# Altium project 15336-ROM3_tablet_RJ12.PrjPcb
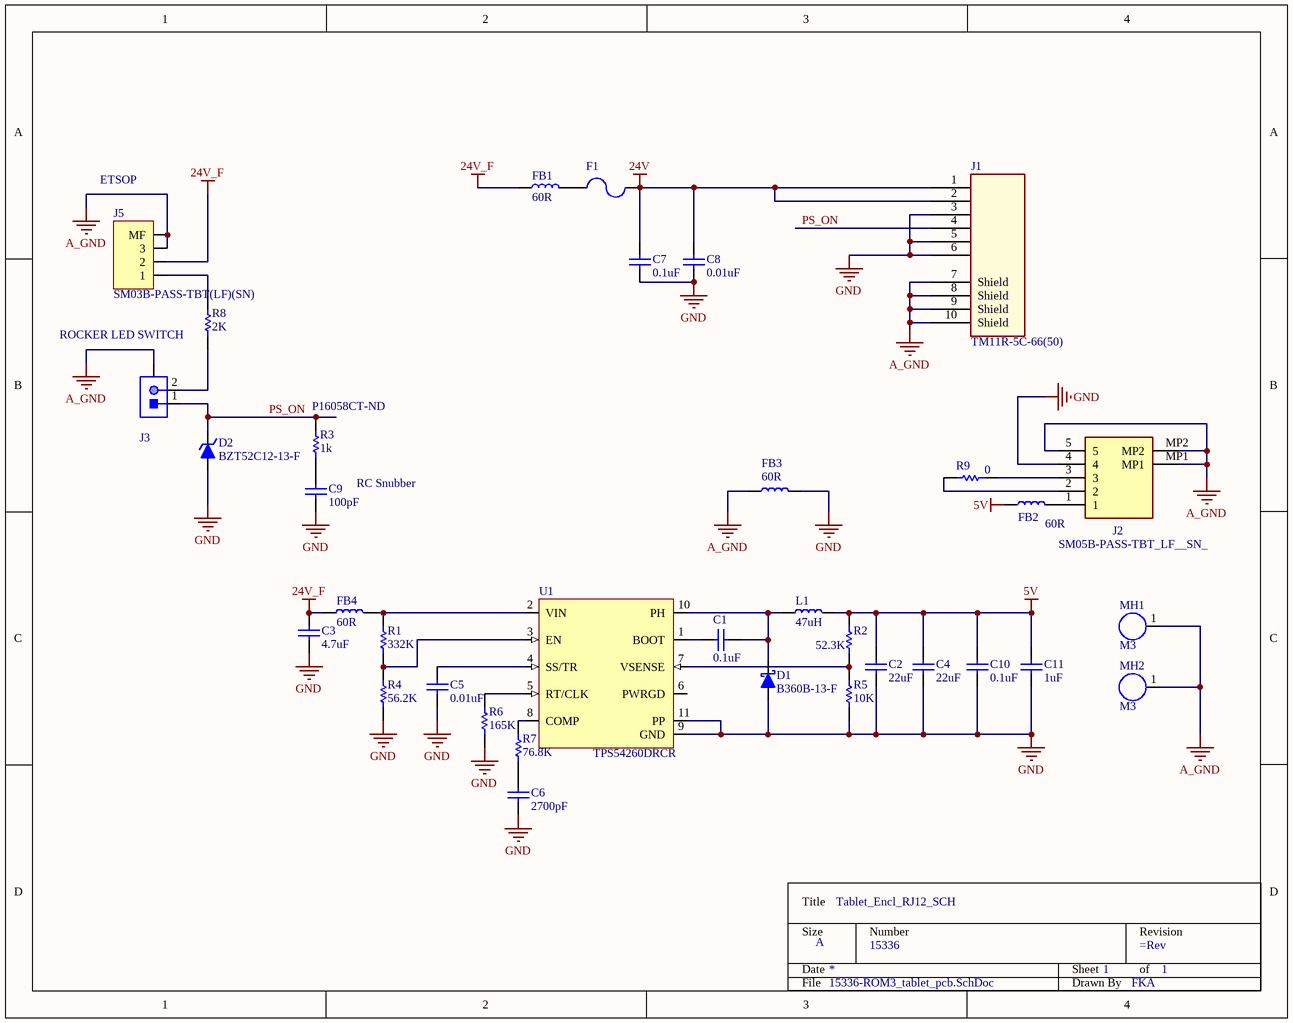
[diagram p0: 15336-ROM3_tablet_pcb.SchDoc]
Company: ROM Tech; PartNum: 15336; Rev: 3
1 sheet, 36 parts. Net scope: global (net labels, ports and power ports of the same name join across sheets).
Board file: 15336-ROM3_tablet_RJ12.PcbDoc

## Sheet 15336-ROM3_tablet_pcb.SchDoc: Tablet_Encl_RJ12_SCH
size A; DrawnBy: FKA; DocumentNumber: 15336; Revision: 3; SheetNumber: 1; SheetTotal: 1

### Parts
?  (no value)  (graphical)
C1  0.1uF  [CAPC0402X06N]
C2  22uF  [CAPC0603X10N]
C3  4.7uF  [CAPC0603X10N]
C4  22uF  [CAPC0603X10N]
C5  0.01uF  [CAPC0402X06N]
C6  2700pF  [CAPC0402X06N]
C7  0.1uF  [CAPC0402X06N]
C8  0.01uF  [CAPC0402X06N]
C9  100pF  [CAPC0603X10N]
C10  0.1uF  [CAPC0402X06N]
C11  1uF  [CAPC0402X06N]
D1  B360B-13-F  [SMB]
D2  BZT52C12-13-F  [SOD-123/Mini-SMA]
F1  Fuse  [FUSE2920]  (value not drawn)
FB1  60R  [Ferrite 0805]
FB2  60R  [Ferrite 0805]
FB3  60R  [Ferrite 0805]
FB4  60R  [Ferrite 0805]
J1  TM11R-5C-66(50)  [RJ12]
J2  SM05B-PASS-TBT_LF__SN_  [SM05BPASSTBTLFSN]
J3  SM02B-PASS-TBT(LF)(SN)  [SM02B-PASS-TBT(LF)(SN)]  (value not drawn)
J5  SM03B-PASS-TBT(LF)(SN)  [SM03B-PASS-TBT(LF)(SN)]
L1  47uH  [SRN1060]
MH1  M3  [M3_Hole]
MH2  M3  [M3_Hole]
R1  332K  [RESC0402X04N]
R2  52.3K  [RESC0402X04N]
R3  1k  Supplier Part Number 1: P16058CT-ND  [RESC0805X06N]
R4  56.2K  [RESC0402X04N]
R5  10K  [RESC0402X04N]
R6  165K  [RESC0402X04N]
R7  76.8K  [RESC0402X04N]
R8  2K  [RESC1206X09N]
R9  0  [RESC0603X06N]
U1  TPS54260DRCR  [10-VSON (3x3) EXPOSED]

### Nets
5V: C2.2 C4.2 C10.1 C11.2 FB2.1 L1.2 R2.1
24V: C7.1 C8.2 F1.2 J1.1 J1.2
24V_F: C3.2 FB1.1 FB4.1 J5.2
A_GND: FB3.1 J1.7(Shield) J1.8(Shield) J1.9(Shield) J1.10(Shield) J2.5 J2.MP1 J2.MP2 J3.3(MF) J5.3 J5.MF MH1.1 MH2.1
GND: C2.1 C3.1 C4.1 C5.1 C6.1 C7.2 C8.1 C9.2 C10.2 C11.1 D1.1(A) D2.1(A) FB3.2 J1.3 J1.5 J1.6 J2.4 R4.1 R5.2 R6.1 U1.9(GND) U1.11(PP)
PS_ON: D2.2(K) J1.4 J3.1 R3.2
NetC1_1: C1.1 D1.2(K) L1.1 U1.10(PH)
NetC1_2: C1.2 U1.1(BOOT)
NetC5_2: C5.2 U1.4(SS/TR)
NetC6_2: C6.2 R7.2
NetC9_1: C9.1 R3.1
NetF1_1: F1.1 FB1.2
NetFB2_2: FB2.2 J2.1
NetFB4_2: FB4.2 R1.2 U1.2(VIN)
NetJ2_2: J2.2 R9.1
NetJ2_3: J2.3 R9.2
NetJ3_2: J3.2 R8.1
NetJ5_1: J5.1 R8.2
NetR1_1: R1.1 R4.2 U1.3(EN)
NetR2_2: R2.2 R5.1 U1.7(VSENSE)
NetR6_2: R6.2 U1.5(RT/CLK)
NetR7_1: R7.1 U1.8(COMP)

Not connected (* = marked no-connect by the designer): U1 6(PWRGD)

### Notes on the sheet
- (near J5) ETSOP
- ROCKER LED SWITCH
- RC Snubber
- Title
- Size
- Date
- A
- Number
- Sheet
- Revision
- of
- File
- Drawn By

### Library data of the parts
? = Title Block Standard_+
C1 C7 C10 = Cap NP: 0.1µF ±10% 50V Ceramic Capacitor X5R 0402 (1005 Metric); Manufacturer 1: Yageo; Manufacturer Part Number 1: CC0402KRX5R9BB104; Capacitance: 100nF; Value: 0.1uF; Supplier 1: Digi-Key; Supplier Part Number 1: 311-3342-2-ND; Stock 1: 827511; Pricing 1: 10000=0.00666, 20000=0.00634, 30000=0.00602, 50000=0.00539, 100000=0.00476 (USD); RoHS: Yes; Mount: Surface Mount; Case/Package: 0402; Min Operating Temperature: -55°C; Max Operating Temperature: 85°C; Packaging: Tape and Reel; Voltage Rating: 50V; Tolerance: 10%; Voltage Rating (DC): 50V; Dielectric: X5R; Length: 0.039inch; Width: 0.02inch; Thickness: 0.022inch; Lead Free: Lead Free; Halogen Free: Halogen Free; ComponentLink1URL: http://www.yageo.com/documents/recent/UPY-GPHC_X5R_4V-to-50V_23.pdf?src-supplier=Digi-Key; ComponentLink1Description: http://www.yageo.com/documents/recent/UPY-GPHC_X5R_4V-to-50V_23.pdf?src-supplier=Digi-Key; ComponentLink2URL: http://www.yageo.com/documents/recent/UPY-GPHC_X5R_4V-to-50V_25.pdf?src-supplier=Digi-Key; ComponentLink2Description: http://www.yageo.com/documents/recent/UPY-GPHC_X5R_4V-to-50V_25.pdf?src-supplier=Digi-Key
C2 C4 = Cap NP: 22µF ±20% 6.3V Ceramic Capacitor X5R 0603 (1608 Metric); Manufacturer 1: Murata; Manufacturer Part Number 1: GRM188R60J226MEA0D; Value: 22uF; Supplier 1: Digi-Key; Supplier Part Number 1: 490-7611-2-ND; Stock 1: 5622507; Pricing 1: 4000=0.04731, 8000=0.04475, 12000=0.04245, 28000=0.04091, 100000=0.03580 (USD); RoHS: Yes; Mount: Surface Mount; Case/Package: 0603; Weight: 0.000222oz; Case Code (Metric): 1608; Case Code (Imperial): 0603; Min Operating Temperature: -55°C; Max Operating Temperature: 85°C; Capacitance: 22uF; Tolerance: 20%; Packaging: Tape and Reel; Package Quantity: 4000; Voltage Rating: 6.3V; Dielectric: X5R; Termination: SMD/SMT; Voltage Rating (DC): 6.3V; Length: 1.6mm; Height: 0.8mm; Width: 0.8mm; Thickness: 0.039inch; Depth: 0.8mm; REACH SVHC: No SVHC; Lead Free: Lead Free; ComponentLink1URL: https://datasheet.ciiva.com/29540/partnumbering-e-01-29540441.pdf?src-supplier=Digi-Key; ComponentLink1Description: https://datasheet.ciiva.com/29540/partnumbering-e-01-29540441.pdf?src-supplier=Digi-Key; ComponentLink2URL: https://datasheet.ciiva.com/29540/partnumbering-e-01-29540442.pdf?src-supplier=Digi-Key; ComponentLink2Description: https://datasheet.ciiva.com/29540/partnumbering-e-01-29540442.pdf?src-supplier=Digi-Key; ComponentLink3URL: https://datasheet.ciiva.com/29540/partnumbering-e-01-29540443.pdf?src-supplier=Digi-Key; ComponentLink3Description: https://datasheet.ciiva.com/29540/partnumbering-e-01-29540443.pdf?src-supplier=Digi-Key
C3 = Cap NP: 4.7µF ±10% 35V Ceramic Capacitor X5R 0603 (1608 Metric); Manufacturer 1: Murata; Manufacturer Part Number 1: GRM188R6YA475KE15D; Value: 4.7uF; Supplier 1: Digi-Key; Supplier Part Number 1: 490-7205-2-ND; Stock 1: 280000; Pricing 1: 4000=0.09384, 8000=0.08832, 12000=0.08556, 28000=0.08280, 100000=0.07728 (USD); RoHS: Yes; Mount: Surface Mount; Case/Package: 0603; Weight: 0.000222oz; Case Code (Metric): 1608; Case Code (Imperial): 0603; Material: Ceramic; Min Operating Temperature: -55°C; Max Operating Temperature: 85°C; Capacitance: 4.7uF; Tolerance: 10%; Voltage Rating: 35V; Packaging: Tape and Reel; Package Quantity: 4000; Dielectric: X5R; Voltage: 35V; Termination: SMD/SMT; Composition: Ceramic; Voltage Rating (DC): 35V; Length: 1.6mm; Height: 0.8mm; Width: 0.8mm; Thickness: 0.031inch; Depth: 0.8mm; REACH SVHC: No SVHC; Lead Free: Lead Free; ComponentLink1URL: https://datasheet.ciiva.com/46444/1769893-46444984.pdf?src-supplier=Element14; ComponentLink1Description: https://datasheet.ciiva.com/46444/1769893-46444984.pdf?src-supplier=Element14; ComponentLink2URL: https://datasheet.ciiva.com/46444/1769893-46444985.pdf?src-supplier=Element14; ComponentLink2Description: https://datasheet.ciiva.com/46444/1769893-46444985.pdf?src-supplier=Element14; ComponentLink3URL: https://datasheet.ciiva.com/14906/partnumbering-e-01-14906426.pdf?src-supplier=Digi-Key; ComponentLink3Description: https://datasheet.ciiva.com/14906/partnumbering-e-01-14906426.pdf?src-supplier=Digi-Key; ComponentLink4URL: https://datasheet.ciiva.com/14906/partnumbering-e-01-14906427.pdf?src-supplier=Digi-Key; ComponentLink4Description: https://datasheet.ciiva.com/14906/partnumbering-e-01-14906427.pdf?src-supplier=Digi-Key; ComponentLink5URL: https://datasheet.ciiva.com/14906/partnumbering-e-01-14906428.pdf?src-supplier=Digi-Key; ComponentLink5Description: https://datasheet.ciiva.com/14906/partnumbering-e-01-14906428.pdf?src-supplier=Digi-Key
C5 C8 = Cap NP: 10000pF ±10% 50V Ceramic Capacitor X7R 0402 (1005 Metric); Manufacturer 1: Yageo; Manufacturer Part Number 1: CC0402KRX7R9BB103; Capacitance: 10nF; Value: 0.01uF; Supplier 1: Digi-Key; Supplier Part Number 1: 311-1349-2-ND; Stock 1: 2489775; Pricing 1: 10000=0.00309, 20000=0.00294, 30000=0.00279, 50000=0.00250, 100000=0.00206 (USD); RoHS: Yes; Mount: Surface Mount; Case/Package: 0402; Case Code (Imperial): 0402; Case Code (Metric): 1005; Min Operating Temperature: -55°C; Max Operating Temperature: 125°C; Packaging: Tape and Reel; Voltage Rating: 50V; Package Quantity: 1; Tolerance: 10%; Voltage Rating (DC): 50V; Dielectric: X7R; Termination: SMD/SMT; Composition: Ceramic; Voltage: 50V; Length: 1mm; Height: 0.5mm; Depth: 0.5mm; Width: 0.5mm; Thickness: 0.022inch; Radiation Hardening: No; REACH SVHC: No SVHC; Lead Free: Lead Free; Halogen Free: Halogen Free; ComponentLink1URL: https://datasheet.ciiva.com/26862/getdatasheetpartid-138248-26862642.pdf?src-supplier=Verical; ComponentLink1Description: https://datasheet.ciiva.com/26862/getdatasheetpartid-138248-26862642.pdf?src-supplier=Verical; ComponentLink2URL: https://datasheet.ciiva.com/11788/0900766b8079c870-11788375.pdf?src-supplier=RSComponents; ComponentLink2Description: https://datasheet.ciiva.com/11788/0900766b8079c870-11788375.pdf?src-supplier=RSComponents; ComponentLink3URL: https://datasheet.ciiva.com/16625/upy-gphc-x7r-6-3v-to-50v-8-16625513.pdf?src-supplier=Avnet+Europe; ComponentLink3Description: https://datasheet.ciiva.com/16625/upy-gphc-x7r-6-3v-to-50v-8-16625513.pdf?src-supplier=Avnet+Europe; ComponentLink4URL: https://datasheet.ciiva.com/28450/1489800-28450377.pdf?src-supplier=Element14; ComponentLink4Description: https://datasheet.ciiva.com/28450/1489800-28450377.pdf?src-supplier=Element14; ComponentLink5URL: https://datasheet.ciiva.com/176/mlccorderingcode-176348.pdf?src-supplier=Digi-Key; ComponentLink5Description: https://datasheet.ciiva.com/176/mlccorderingcode-176348.pdf?src-supplier=Digi-Key; ComponentLink6URL: https://datasheet.ciiva.com/176/mlccorderingcode-176349.pdf?src-supplier=Digi-Key; ComponentLink6Description: https://datasheet.ciiva.com/176/mlccorderingcode-176349.pdf?src-supplier=Digi-Key; ComponentLink7URL: https://datasheet.ciiva.com/7978/1489800-7978093.pdf?src-supplier=Element14; ComponentLink7Description: https://datasheet.ciiva.com/7978/1489800-7978093.pdf?src-supplier=Element14; ComponentLink8URL: https://datasheet.ciiva.com/176/mlccorderingcode-176350.pdf?src-supplier=Digi-Key; ComponentLink8Description: https://datasheet.ciiva.com/176/mlccorderingcode-176350.pdf?src-supplier=Digi-Key
C6 = Cap NP: 2700pF ±10% 50V Ceramic Capacitor X7R 0402 (1005 Metric); Manufacturer 1: Murata; Manufacturer Part Number 1: GRM155R71H272KA01J; Capacitance: 2.7nF; Value: 2700pF; Supplier 1: Digi-Key; Supplier Part Number 1: 490-6361-2-ND; Stock 1: 250000; Pricing 1: 50000=0.00391, 100000=0.00345 (USD); RoHS: Yes; Mount: Surface Mount; Case/Package: 0402; Case Code (Metric): 1005; Case Code (Imperial): 0402; Min Operating Temperature: -55°C; Max Operating Temperature: 125°C; Tolerance: 10%; Packaging: Tape and Reel; Package Quantity: 50000; Voltage Rating: 50V; Voltage Rating (DC): 50V; Dielectric: X7R; Termination: SMD/SMT; Voltage: 50V; Length: 1mm; Height: 0.5mm; Width: 0.02inch; Thickness: 0.022inch; Depth: 0.5mm; Radiation Hardening: No; ComponentLink1URL: https://datasheet.ciiva.com/6271/partnumbering-e-01-6271238.pdf?src-supplier=Digi-Key; ComponentLink1Description: https://datasheet.ciiva.com/6271/partnumbering-e-01-6271238.pdf?src-supplier=Digi-Key; ComponentLink2URL: https://datasheet.ciiva.com/6271/partnumbering-e-01-6271240.pdf?src-supplier=Digi-Key; ComponentLink2Description: https://datasheet.ciiva.com/6271/partnumbering-e-01-6271240.pdf?src-supplier=Digi-Key; ComponentLink3URL: https://datasheet.ciiva.com/6271/partnumbering-e-01-6271242.pdf?src-supplier=Digi-Key; ComponentLink3Description: https://datasheet.ciiva.com/6271/partnumbering-e-01-6271242.pdf?src-supplier=Digi-Key; ComponentLink4URL: https://datasheet.ciiva.com/11620/product-11620523.pdf?src-supplier=Avnet; ComponentLink4Description: https://datasheet.ciiva.com/11620/product-11620523.pdf?src-supplier=Avnet
C9 = Cap NP: Non-polarized Capactior; Value: 100pF; Supplier 1: Digi-Key; Supplier Part Number 1: 490-11435-1-ND
C11 = Cap NP: 1µF ±10% 6.3V Ceramic Capacitor X5R 0402 (1005 Metric); Manufacturer 1: KEMET; Manufacturer Part Number 1: C0402C105K9PACTU; Value: 1uF; Supplier 1: Digi-Key; Supplier Part Number 1: 399-4873-2-ND; Stock 1: 1587114; Pricing 1: 10000=0.00439, 20000=0.00418, 30000=0.00397, 50000=0.00355, 100000=0.00287 (USD); RoHS: Yes; Mount: Surface Mount; Case/Package: 0402; Number of Pins: 2; Case Code (Imperial): 0402; Dielectric Material: Ceramic; Min Operating Temperature: -55°C; Max Operating Temperature: 85°C; Capacitance: 1uF; Tolerance: 10%; Packaging: Tape and Reel; Voltage Rating: 6.3V; Dielectric: X5R; Voltage: 6.3V; Termination: SMD/SMT; Voltage Rating (DC): 6.3V; Package Quantity: 1; Length: 1mm; Height: 0.5mm; Width: 0.02inch; Thickness: 0.022inch; Depth: 0.5mm; Lead Pitch: 0.3mm; Radiation Hardening: No; Lead Free: Lead Free; REACH SVHC: No SVHC; ComponentLink1URL: https://datasheet.ciiva.com/11786/0900766b8116eb59-11786028.pdf?src-supplier=RSComponents; ComponentLink1Description: https://datasheet.ciiva.com/11786/0900766b8116eb59-11786028.pdf?src-supplier=RSComponents; ComponentLink2URL: https://datasheet.ciiva.com/28645/1789732-28645392.pdf?src-supplier=Element14; ComponentLink2Description: https://datasheet.ciiva.com/28645/1789732-28645392.pdf?src-supplier=Element14; ComponentLink3URL: https://datasheet.ciiva.com/7747/kem-c1006-x5r-smd-7747445.pdf?src-supplier=Element14; ComponentLink3Description: https://datasheet.ciiva.com/7747/kem-c1006-x5r-smd-7747445.pdf?src-supplier=Element14; ComponentLink4URL: https://datasheet.ciiva.com/7747/40889-7747623.pdf?src-supplier=Element14; ComponentLink4Description: https://datasheet.ciiva.com/7747/40889-7747623.pdf?src-supplier=Element14
D1 = B360B-13-F: Diode Schottky 60V 3A Surface Mount SMB; Manufacturer 1: Diodes; Forward Voltage: 700mV; Peak Reverse Current: 500uA; Max Forward Surge Current (Ifsm): 100A; Element Configuration: Single; Polarity: Standard; Capacitance: 250pF; Supplier 1: Digi-Key; Supplier Part Number 1: B360B-FDITR-ND; Stock 1: 54000; Pricing 1: 3000=0.14090, 6000=0.12726, 15000=0.11817, 30000=0.11544, 75000=0.11181 (USD); RoHS: Yes; Packaging: Tape and Reel; Height: 2.5mm; Length: 4.57mm; Width: 3.94mm; ComponentLink1URL: https://datasheet.ciiva.com/34302/1538911-34302362.pdf?src-supplier=Jameco; ComponentLink1Description: https://datasheet.ciiva.com/34302/1538911-34302362.pdf?src-supplier=Jameco; ComponentLink2URL: https://datasheet.ciiva.com/26949/getdatasheetpartid-142114-26949359.pdf?src-supplier=Verical; ComponentLink2Description: https://datasheet.ciiva.com/26949/getdatasheetpartid-142114-26949359.pdf?src-supplier=Verical; ComponentLink3URL: https://datasheet.ciiva.com/1177/ds30924-1177528.pdf?src-supplier=Element14; ComponentLink3Description: https://datasheet.ciiva.com/1177/ds30924-1177528.pdf?src-supplier=Element14; Manufacturer Part Number 1: B360B-13-F; Mount: Surface Mount; Case/Package: SMB; Number of Pins: 2; Weight: 0.00328oz; Contact Plating: Tin,Matte; Min Operating Temperature: -55°C; Max Operating Temperature: 150°C; Current: 3A; Voltage: 60V; Package Quantity: 3000; Forward Current: 3A; Average Rectified Current: 3A; Max Repetitive Reverse Voltage (Vrrm): 60V; Peak Non-Repetitive Surge Current: 100A; Termination: SMD/SMT; Voltage Rating (DC): 60V; Current Rating: 3A; Output Current: 3A; Max Reverse Voltage (DC): 60V; Radiation Hardening: No; REACH SVHC: No SVHC; Lead Free: Lead Free
D2 = BZT52C12-13-F: Zener Diode 12V 500mW ±5% Surface Mount SOD-123; Manufacturer 1: Diodes; Impedance: 25R; Peak Reverse Current: 100nA; Test Current: 5mA; Element Configuration: Single; Forward Voltage: 900mV; Output Current: 50mA; ESD Protection: No; Supplier 1: Digi-Key; Manufacturer Part Number 1: BZT52C12-13-F; Stock 1: 88458; Pricing 1: 10000=0.02576, 30000=0.02530, 50000=0.02273, 100000=0.02015, 250000=0.01970 (USD); RoHS: Yes; Mount: Surface Mount; Case/Package: SOD-123-2; Number of Pins: 2; Weight: 0.000353oz; Contact Plating: Tin,Matte; Min Operating Temperature: -65°C; Max Operating Temperature: 150°C; Max Power Dissipation: 500mW; Packaging: Tape and Reel; Package Quantity: 10000; Tolerance: 5%; Zener Voltage: 12V; Voltage Tolerance: 5%; Max Reverse Leakage Current: 100nA; Power Dissipation: 500mW; Zener Current: 100nA; Power Rating: 500mW; Length: 2.85mm; Height: 1.35mm; Width: 1.7mm; Radiation Hardening: No; Lead Free: Lead Free; ComponentLink1URL: https://datasheet.ciiva.com/26943/getdatasheetpartid-38893-26943274.pdf?src-supplier=Verical; ComponentLink1Description: https://datasheet.ciiva.com/26943/getdatasheetpartid-38893-26943274.pdf?src-supplier=Verical; Supplier Part Number 1: BZT52C1213-FDITR-ND; Voltage Rating (DC): 12V
F1 = Fuse: Polymeric PTC Resettable Fuse 33V 1.85A Ih Surface Mount 2920 (7351 Metric), Concave; Manufacturer 1: Bel; Manufacturer Part Number 1: 0ZCF0185FF2C; Max Current Rating: 40A; Trip Current: 3.7A; Time to Trip: 2.5s; Supplier 1: Digi-Key; Supplier Part Number 1: 507-1747-2-ND; Stock 1: 76000; Pricing 1: 2000=0.13090, 4000=0.12320, 6000=0.11550, 10000=0.10780 (USD); RoHS: Yes; Case Code (Metric): 7351; Case Code (Imperial): 2920; Package Quantity: 1; Packaging: Tape and Reel; Hold Current: 1.85A; Lead Free: Lead Free; ComponentLink1URL: https://datasheet.ciiva.com/18550/0zcf-18550652.pdf?src-supplier=Digi-Key; ComponentLink1Description: https://datasheet.ciiva.com/18550/0zcf-18550652.pdf?src-supplier=Digi-Key; ComponentLink2URL: https://datasheet.ciiva.com/18550/0zcf-18550653.pdf?src-supplier=Digi-Key; ComponentLink2Description: https://datasheet.ciiva.com/18550/0zcf-18550653.pdf?src-supplier=Digi-Key; ComponentLink3URL: https://datasheet.ciiva.com/18550/0zcf-18550654.pdf?src-supplier=Digi-Key; ComponentLink3Description: https://datasheet.ciiva.com/18550/0zcf-18550654.pdf?src-supplier=Digi-Key
FB1-FB4 = Ferrite: 60 Ohms @ 100MHz 1 Power Line Ferrite Bead 0805 (2012 Metric) 3A 25mOhm; Manufacturer 1: Taiyo Yuden; Manufacturer Part Number 1: BKP2125HS600-T; Tolerance: 25%; Resistance: 25mR; Number of Lines: 1; Shielding: Unshielded; Value: 60R; Supplier 1: Digi-Key; Supplier Part Number 1: 587-1932-2-ND; Stock 1: 1324000; Pricing 1: 4000=0.01936, 8000=0.01755, 12000=0.01694, 28000=0.01573, 100000=0.01555 (USD); RoHS: Yes; Mount: Surface Mount; Case/Package: 0805; Number of Pins: 2; Core Material: Ferrite; Case Code (Metric): 2125; Case Code (Imperial): 0805; Min Operating Temperature: -55°C; Max Operating Temperature: 85°C; Packaging: Tape and Reel; Impedance: 60R; Package Quantity: 1; Max Current Rating: 3A; DC Resistance (DCR): 25mR; Max DC Current: 3A; Termination: SMD/SMT; Test Frequency: 100MHz; Length: 2.3mm; Height: 1.05mm; Width: 0.049inch; Depth: 1.45mm; REACH SVHC: Unknown; Lead Free: Lead Free; Halogen Free: Halogen Free; ComponentLink1URL: https://datasheet.ciiva.com/6213/bkp2125hs600-t-ss-6213090.pdf?src-supplier=Digi-Key; ComponentLink1Description: https://datasheet.ciiva.com/6213/bkp2125hs600-t-ss-6213090.pdf?src-supplier=Digi-Key; ComponentLink2URL: https://datasheet.ciiva.com/30063/884bkp2125hs600-t-30063956.pdf?src-supplier=Onlinecomponents.com; ComponentLink2Description: https://datasheet.ciiva.com/30063/884bkp2125hs600-t-30063956.pdf?src-supplier=Onlinecomponents.com; ComponentLink3URL: https://datasheet.ciiva.com/6213/mlci08-e-6213094.pdf?src-supplier=Digi-Key; ComponentLink3Description: https://datasheet.ciiva.com/6213/mlci08-e-6213094.pdf?src-supplier=Digi-Key; ComponentLink4URL: https://datasheet.ciiva.com/6213/mlci08-e-6213097.pdf?src-supplier=Digi-Key; ComponentLink4Description: https://datasheet.ciiva.com/6213/mlci08-e-6213097.pdf?src-supplier=Digi-Key
J1 = RJ12: CONN MOD JACK 6P6C R/A SHIELDED; Manufacturer 1: Hirose Electric company; Supplier 1: Digi-Key; Supplier Part Number 1: H124439-ND; Manufacturer Part Number 1: TM11R-5C-66(50)
J2 = SM05B-PASS-TBT_LF__SN_: Connector; Manufacturer 1: JST (JAPAN SOLDERLESS TERMINALS); Manufacturer Part Number 1: SM05B-PASS-TBT(LF)(SN); Datasheet Link: http://www.jst-mfg.com/product/pdf/eng/ePA-F.pdf; Height: 5.7mm
J3 = SM02B-PASS-TBT(LF)(SN): CONN HEADER SMD R/A 2POS 2MM; Manufacturer 1: JST; Number of Positions: 2; Connector Type: Male Pin; Pitch: 0.079inch; System: Connector; Supplier 1: Digi-Key; Manufacturer Part Number 1: SM02B-PASS-TBT(LF)(SN); Stock 1: 191000; Pricing 1: 1000=0.30811, 2000=0.29877, 3000=0.28010, 5000=0.27076, 10000=0.25209, 25000=0.24275 (USD); RoHS: Yes; Mount: Surface Mount; Color: Natural; Contact Plating: Tin; Number of Rows: 1; Fastening Type: Ramp; Packaging: Cut Tape; Termination: Solder; Lead Free: Lead Free; ComponentLink1URL: https://datasheet.ciiva.com/740/epa-f-740784.pdf?src-supplier=Digi-Key; ComponentLink1Description: https://datasheet.ciiva.com/740/epa-f-740784.pdf?src-supplier=Digi-Key; ComponentLink2URL: https://datasheet.ciiva.com/16487/epa-f-16487127.pdf?src-supplier=Future+Electronics; ComponentLink2Description: https://datasheet.ciiva.com/16487/epa-f-16487127.pdf?src-supplier=Future+Electronics; ComponentLink3URL: https://datasheet.ciiva.com/726/epa-f-726798.pdf?src-supplier=Digi-Key; ComponentLink3Description: https://datasheet.ciiva.com/726/epa-f-726798.pdf?src-supplier=Digi-Key; ComponentLink4URL: https://datasheet.ciiva.com/740/epa-f-740798.pdf?src-supplier=Digi-Key; ComponentLink4Description: https://datasheet.ciiva.com/740/epa-f-740798.pdf?src-supplier=Digi-Key; Supplier Part Number 1: 455-2650-2-ND
J5 = SM03B-PASS-TBT(LF)(SN): Connector Header Surface Mount, Right Angle 3 position 0.079" (2.00mm); Manufacturer 1: JST; Number of Positions: 3; Connector Type: Male Pin; Gender: Male; Pitch: 0.079inch; Supplier 1: Digi-Key; Manufacturer Part Number 1: SM03B-PASS-TBT(LF)(SN); Stock 1: 48000; Pricing 1: 1000=0.40754, 2000=0.39519, 3000=0.37049, 5000=0.35814, 10000=0.33344, 25000=0.32109 (USD); RoHS: Yes; Mount: Surface Mount; Color: Natural; Contact Plating: Tin; Contact Material: Copper; Fastening Type: Ramp; Packaging: Cut Tape; Number of Rows: 1; Termination: Solder; Lead Free: Lead Free; ComponentLink1URL: https://datasheet.ciiva.com/740/epa-f-740785.pdf?src-supplier=Digi-Key; ComponentLink1Description: https://datasheet.ciiva.com/740/epa-f-740785.pdf?src-supplier=Digi-Key; ComponentLink2URL: https://datasheet.ciiva.com/740/epa-f-740771.pdf?src-supplier=Digi-Key; ComponentLink2Description: https://datasheet.ciiva.com/740/epa-f-740771.pdf?src-supplier=Digi-Key; ComponentLink3URL: https://datasheet.ciiva.com/740/epa-f-740799.pdf?src-supplier=Digi-Key; ComponentLink3Description: https://datasheet.ciiva.com/740/epa-f-740799.pdf?src-supplier=Digi-Key; ComponentLink4URL: https://datasheet.ciiva.com/16487/epa-f-16487215.pdf?src-supplier=Future+Electronics; ComponentLink4Description: https://datasheet.ciiva.com/16487/epa-f-16487215.pdf?src-supplier=Future+Electronics; Supplier Part Number 1: 455-2644-2-ND; System: Connector
L1 = Inductor: Manufacturer 1: Bourns; Manufacturer Part Number 1: SRN1060-470M; Supplier 1: Digi-Key; Supplier Part Number 1: SRN1060-470MCT-ND
MH1 MH2 = Component_1
R1 = Res: 332 kOhms ±1% 0.1W, 1/10W Chip Resistor 0402 (1005 Metric) Automotive AEC-Q200 Thick Film; Manufacturer 1: Panasonic; Manufacturer Part Number 1: ERJ-2RKF3323X; Resistance: 332kR; Power Rating: 100mW; Voltage Rating: 50V; Temperature Coefficient: 100ppm/°C; VALUE: 332K; Supplier 1: Digi-Key; Supplier Part Number 1: P332KLTR-ND; Stock 1: 250000; Pricing 1: 10000=0.00466, 30000=0.00410, 50000=0.00376, 100000=0.00368 (USD); RoHS: Yes; Mount: Surface Mount; Case/Package: 0402; Case Code (Metric): 1005; Case Code (Imperial): 0402; Contact Plating: Tin; Min Operating Temperature: -55°C; Max Operating Temperature: 155°C; Tolerance: 1%; Packaging: Tape and Reel; Package Quantity: 1; Composition: Thick Film; Number of Terminations: 2; Termination: SMD/SMT; Military Standard: Not; Max Power Dissipation: 100mW; Voltage Rating (DC): 50V; Features: Automotive AEC-Q200; Length: 1mm; Height: 0.016inch; Width: 0.02inch; Depth: 0.5mm; REACH SVHC: Yes; Lead Free: Lead Free; ComponentLink1URL: https://datasheet.ciiva.com/9182/aoa0000ce2-9182903.pdf?src-supplier=Avnet; ComponentLink1Description: https://datasheet.ciiva.com/9182/aoa0000ce2-9182903.pdf?src-supplier=Avnet; ComponentLink2URL: https://datasheet.ciiva.com/43467/1678782-43467528.pdf?src-supplier=Farnell; ComponentLink2Description: https://datasheet.ciiva.com/43467/1678782-43467528.pdf?src-supplier=Farnell; ComponentLink3URL: https://datasheet.ciiva.com/16784/70260748-16784778.pdf?src-supplier=Allied+Electronics; ComponentLink3Description: https://datasheet.ciiva.com/16784/70260748-16784778.pdf?src-supplier=Allied+Electronics; ComponentLink4URL: https://datasheet.ciiva.com/22672/1678782-22672842.pdf?src-supplier=Element14; ComponentLink4Description: https://datasheet.ciiva.com/22672/1678782-22672842.pdf?src-supplier=Element14; ComponentLink5URL: https://datasheet.ciiva.com/28548/1694929-28548443.pdf?src-supplier=Element14; ComponentLink5Description: https://datasheet.ciiva.com/28548/1694929-28548443.pdf?src-supplier=Element14; ComponentLink6URL: https://datasheet.ciiva.com/9182/aoa0000ce2-9182906.pdf?src-supplier=Avnet; ComponentLink6Description: https://datasheet.ciiva.com/9182/aoa0000ce2-9182906.pdf?src-supplier=Avnet; ComponentLink7URL: https://datasheet.ciiva.com/24068/aoa0000ce2-24068894.pdf?src-supplier=Mouser; ComponentLink7Description: https://datasheet.ciiva.com/24068/aoa0000ce2-24068894.pdf?src-supplier=Mouser
R2 = Res: 52.3 kOhms ±1% 0.1W, 1/10W Chip Resistor 0402 (1005 Metric) Automotive AEC-Q200 Thick Film; Manufacturer 1: Panasonic; Manufacturer Part Number 1: ERJ-2RKF5232X; Resistance: 52.3kR; Voltage Rating: 50V; Power Rating: 100mW; Temperature Coefficient: 100ppm/°C; VALUE: 52.3K; Supplier 1: Digi-Key; Supplier Part Number 1: P52.3KLTR-ND; Stock 1: 210000; Pricing 1: 10000=0.00466, 30000=0.00410, 50000=0.00376, 100000=0.00368 (USD); RoHS: Yes; Mount: Surface Mount; Case/Package: 0402; Case Code (Imperial): 0402; Case Code (Metric): 1005; Contact Plating: Tin; Min Operating Temperature: -55°C; Max Operating Temperature: 155°C; Tolerance: 1%; Packaging: Tape and Reel; Package Quantity: 1; Termination: SMD/SMT; Composition: Thick Film; Number of Terminations: 2; Military Standard: Not; Max Power Dissipation: 100mW; Voltage Rating (DC): 50V; Features: Automotive AEC-Q200; Length: 1mm; Height: 0.016inch; Width: 0.5mm; Depth: 0.5mm; REACH SVHC: No SVHC; Lead Free: Lead Free; ComponentLink1URL: https://datasheet.ciiva.com/3883/3984280s8821682n1386-3883650.pdf?src-supplier=Arrow; ComponentLink1Description: https://datasheet.ciiva.com/3883/3984280s8821682n1386-3883650.pdf?src-supplier=Arrow; ComponentLink2URL: https://datasheet.ciiva.com/6201/426256-6201381.pdf?src-supplier=Farnell; ComponentLink2Description: https://datasheet.ciiva.com/6201/426256-6201381.pdf?src-supplier=Farnell; ComponentLink3URL: https://datasheet.ciiva.com/9188/aoa0000ce2-9188938.pdf?src-supplier=Avnet; ComponentLink3Description: https://datasheet.ciiva.com/9188/aoa0000ce2-9188938.pdf?src-supplier=Avnet; ComponentLink4URL: https://datasheet.ciiva.com/46389/426256-46389115.pdf?src-supplier=Element14; ComponentLink4Description: https://datasheet.ciiva.com/46389/426256-46389115.pdf?src-supplier=Element14; ComponentLink5URL: https://datasheet.ciiva.com/43460/426256-43460332.pdf?src-supplier=Farnell; ComponentLink5Description: https://datasheet.ciiva.com/43460/426256-43460332.pdf?src-supplier=Farnell; ComponentLink6URL: https://datasheet.ciiva.com/16781/70260748-16781070.pdf?src-supplier=Allied+Electronics; ComponentLink6Description: https://datasheet.ciiva.com/16781/70260748-16781070.pdf?src-supplier=Allied+Electronics
R3 = Res: Resistor; Manufacturer 1: Panasonic; Manufacturer Part Number 1: ERJ-P06F1001V; VALUE: 1k; ComponentLink1Description: New link; ComponentLink1URL: *; Supplier 1: Digi-Key
R4 = Res: 56.2 kOhms ±1% 0.1W, 1/10W Chip Resistor 0402 (1005 Metric) Automotive AEC-Q200 Thick Film; Manufacturer 1: Panasonic; Manufacturer Part Number 1: ERJ-2RKF5622X; Resistance: 56.2kR; Power Rating: 100mW; Voltage Rating: 50V; Temperature Coefficient: 100ppm/°C; VALUE: 56.2K; Supplier 1: Digi-Key; Supplier Part Number 1: P56.2KLTR-ND; Stock 1: 240000; Pricing 1: 10000=0.00466, 30000=0.00410, 50000=0.00376, 100000=0.00368 (USD); RoHS: Yes; Mount: Surface Mount; Case/Package: 0402; Weight: 2.8E-05oz; Case Code (Metric): 1005; Case Code (Imperial): 0402; Contact Plating: Tin; Min Operating Temperature: -55°C; Max Operating Temperature: 155°C; Tolerance: 1%; Packaging: Tape and Reel; Package Quantity: 1; Composition: Thick Film; Number of Terminations: 2; Termination: SMD/SMT; Military Standard: Not; Max Power Dissipation: 100mW; Voltage Rating (DC): 50V; Features: Automotive AEC-Q200; Length: 1mm; Height: 0.016inch; Width: 0.02inch; Depth: 0.5mm; REACH SVHC: No SVHC; Lead Free: Lead Free; ComponentLink1URL: https://datasheet.ciiva.com/30228/aoa0000ce2-30228952.pdf?src-supplier=Onlinecomponents.com; ComponentLink1Description: https://datasheet.ciiva.com/30228/aoa0000ce2-30228952.pdf?src-supplier=Onlinecomponents.com; ComponentLink2URL: https://datasheet.ciiva.com/28695/1678782-28695787.pdf?src-supplier=Element14; ComponentLink2Description: https://datasheet.ciiva.com/28695/1678782-28695787.pdf?src-supplier=Element14; ComponentLink3URL: https://datasheet.ciiva.com/9188/aoa0000ce2-9188636.pdf?src-supplier=Avnet; ComponentLink3Description: https://datasheet.ciiva.com/9188/aoa0000ce2-9188636.pdf?src-supplier=Avnet; ComponentLink4URL: https://datasheet.ciiva.com/43460/426256-43460333.pdf?src-supplier=Farnell; ComponentLink4Description: https://datasheet.ciiva.com/43460/426256-43460333.pdf?src-supplier=Farnell; ComponentLink5URL: https://datasheet.ciiva.com/46377/426256-46377549.pdf?src-supplier=Element14; ComponentLink5Description: https://datasheet.ciiva.com/46377/426256-46377549.pdf?src-supplier=Element14; ComponentLink6URL: https://datasheet.ciiva.com/24124/aoa0000ce2-24124319.pdf?src-supplier=Mouser; ComponentLink6Description: https://datasheet.ciiva.com/24124/aoa0000ce2-24124319.pdf?src-supplier=Mouser
R5 = Res: 10 kOhms ±1% 0.063W, 1/16W Chip Resistor 0402 (1005 Metric)  Thick Film; Manufacturer 1: Bourns; Manufacturer Part Number 1: CR0402-FX-1002GLF; Resistance: 10kR; Power Rating: 62.5mW; Voltage Rating: 50V; Temperature Coefficient: 100ppm/°C; Max Power Dissipation: 63mW; VALUE: 10K; Supplier 1: Digi-Key; Supplier Part Number 1: CR0402-FX-1002GLFTR-ND; Stock 1: 320000; Pricing 1: 10000=0.00466, 30000=0.00410, 50000=0.00376, 100000=0.00368 (USD); RoHS: Yes; Mount: Surface Mount; Case/Package: 0402; Case Code (Metric): 1005; Case Code (Imperial): 0402; Contact Plating: Tin; Min Operating Temperature: -55°C; Max Operating Temperature: 125°C; Packaging: Tape and Reel; Tolerance: 1%; Package Quantity: 10000; Composition: Thick Film; Number of Terminations: 2; Termination: SMD/SMT; Military Standard: Not; Voltage Rating (DC): 50V; Length: 1mm; Height: 0.35mm; Width: 0.5mm; Depth: 0.5mm; Thickness: 356um; Radiation Hardening: No; REACH SVHC: No SVHC; ComponentLink1URL: https://datasheet.ciiva.com/30490/0900766b812730ae-30490501.pdf?src-supplier=RSComponents; ComponentLink1Description: https://datasheet.ciiva.com/30490/0900766b812730ae-30490501.pdf?src-supplier=RSComponents; ComponentLink2URL: https://datasheet.ciiva.com/6562/cr0402-6562871.pdf?src-supplier=Digi-Key; ComponentLink2Description: https://datasheet.ciiva.com/6562/cr0402-6562871.pdf?src-supplier=Digi-Key; ComponentLink3URL: https://datasheet.ciiva.com/6562/cr0402-6562873.pdf?src-supplier=Digi-Key; ComponentLink3Description: https://datasheet.ciiva.com/6562/cr0402-6562873.pdf?src-supplier=Digi-Key; ComponentLink4URL: https://datasheet.ciiva.com/7606/1896412-7606203.pdf?src-supplier=Newark; ComponentLink4Description: https://datasheet.ciiva.com/7606/1896412-7606203.pdf?src-supplier=Newark; ComponentLink5URL: https://datasheet.ciiva.com/3255/cr0402-3255916.pdf?src-supplier=Avnet; ComponentLink5Description: https://datasheet.ciiva.com/3255/cr0402-3255916.pdf?src-supplier=Avnet; ComponentLink6URL: https://datasheet.ciiva.com/30133/cr0402-30133006.pdf?src-supplier=Onlinecomponents.com; ComponentLink6Description: https://datasheet.ciiva.com/30133/cr0402-30133006.pdf?src-supplier=Onlinecomponents.com; ComponentLink7URL: https://datasheet.ciiva.com/6562/cr0402-6562911.pdf?src-supplier=Digi-Key; ComponentLink7Description: https://datasheet.ciiva.com/6562/cr0402-6562911.pdf?src-supplier=Digi-Key; ComponentLink8URL: https://datasheet.ciiva.com/22713/659744-22713205.pdf?src-supplier=Element14; ComponentLink8Description: https://datasheet.ciiva.com/22713/659744-22713205.pdf?src-supplier=Element14; ComponentLink9URL: https://datasheet.ciiva.com/22644/659744-22644166.pdf?src-supplier=Element14; ComponentLink9Description: https://datasheet.ciiva.com/22644/659744-22644166.pdf?src-supplier=Element14; ComponentLink10URL: https://datasheet.ciiva.com/16938/cr0402-16938186.pdf?src-supplier=Avnet+Europe; ComponentLink10Description: https://datasheet.ciiva.com/16938/cr0402-16938186.pdf?src-supplier=Avnet+Europe
R6 = Res: 165 kOhms ±1% 0.1W, 1/10W Chip Resistor 0402 (1005 Metric) Automotive AEC-Q200 Thick Film; Manufacturer 1: Panasonic; Manufacturer Part Number 1: ERJ-2RKF1653X; Voltage Rating: 50V; Resistance: 165kR; Power Rating: 100mW; Temperature Coefficient: 100ppm/°C; VALUE: 165K; Supplier 1: Digi-Key; Supplier Part Number 1: P165KLTR-ND; Stock 1: 170000; Pricing 1: 10000=0.00466, 30000=0.00410, 50000=0.00376, 100000=0.00368 (USD); RoHS: Yes; Mount: Surface Mount; Case/Package: 0402; Weight: 2.8E-05oz; Case Code (Metric): 1005; Case Code (Imperial): 0402; Contact Plating: Tin; Min Operating Temperature: -55°C; Max Operating Temperature: 155°C; Tolerance: 1%; Packaging: Tape and Reel; Package Quantity: 10000; Composition: Thick Film; Number of Terminations: 2; Termination: SMD/SMT; Military Standard: Not; Max Power Dissipation: 100mW; Voltage Rating (DC): 50V; Length: 1mm; Height: 0.016inch; Width: 0.02inch; Depth: 0.5mm; Radiation Hardening: No; REACH SVHC: No SVHC; Lead Free: Lead Free; ComponentLink1URL: https://datasheet.ciiva.com/43460/426256-43460341.pdf?src-supplier=Farnell; ComponentLink1Description: https://datasheet.ciiva.com/43460/426256-43460341.pdf?src-supplier=Farnell; ComponentLink2URL: https://datasheet.ciiva.com/30096/aoa0000ce2-30096043.pdf?src-supplier=Onlinecomponents.com; ComponentLink2Description: https://datasheet.ciiva.com/30096/aoa0000ce2-30096043.pdf?src-supplier=Onlinecomponents.com; ComponentLink3URL: https://datasheet.ciiva.com/9119/aoa0000ce2-9119277.pdf?src-supplier=Avnet; ComponentLink3Description: https://datasheet.ciiva.com/9119/aoa0000ce2-9119277.pdf?src-supplier=Avnet; ComponentLink4URL: https://datasheet.ciiva.com/24160/aoa0000ce2-24160157.pdf?src-supplier=Mouser; ComponentLink4Description: https://datasheet.ciiva.com/24160/aoa0000ce2-24160157.pdf?src-supplier=Mouser; ComponentLink5URL: https://datasheet.ciiva.com/46388/426256-46388701.pdf?src-supplier=Element14; ComponentLink5Description: https://datasheet.ciiva.com/46388/426256-46388701.pdf?src-supplier=Element14; ComponentLink6URL: https://datasheet.ciiva.com/16771/70260748-16771999.pdf?src-supplier=Allied+Electronics; ComponentLink6Description: https://datasheet.ciiva.com/16771/70260748-16771999.pdf?src-supplier=Allied+Electronics
R7 = Res: 76.8 kOhms ±1% 0.1W, 1/10W Chip Resistor 0402 (1005 Metric) Automotive AEC-Q200 Thick Film; Manufacturer 1: Panasonic; Manufacturer Part Number 1: ERJ-2RKF7682X; Voltage Rating: 50V; Power Rating: 100mW; Resistance: 76.8kR; Temperature Coefficient: 100ppm/°C; VALUE: 76.8K; Supplier 1: Digi-Key; Supplier Part Number 1: P76.8KLTR-ND; Stock 1: 360000; Pricing 1: 10000=0.00466, 30000=0.00410, 50000=0.00376, 100000=0.00368 (USD); RoHS: Yes; Mount: Surface Mount; Case/Package: 0402; Case Code (Metric): 1005; Case Code (Imperial): 0402; Contact Plating: Tin; Min Operating Temperature: -55°C; Max Operating Temperature: 155°C; Tolerance: 1%; Packaging: Tape and Reel; Package Quantity: 1; Composition: Thick Film; Number of Terminations: 2; Termination: SMD/SMT; Military Standard: Not; Max Power Dissipation: 100mW; Voltage Rating (DC): 50V; Features: Automotive AEC-Q200; Length: 1mm; Height: 0.35mm; Width: 0.02inch; Depth: 0.5mm; REACH SVHC: Yes; Lead Free: Lead Free; ComponentLink1URL: https://datasheet.ciiva.com/9187/aoa0000ce2-9187639.pdf?src-supplier=Avnet; ComponentLink1Description: https://datasheet.ciiva.com/9187/aoa0000ce2-9187639.pdf?src-supplier=Avnet; ComponentLink2URL: https://datasheet.ciiva.com/30157/aoa0000ce2-30157735.pdf?src-supplier=Onlinecomponents.com; ComponentLink2Description: https://datasheet.ciiva.com/30157/aoa0000ce2-30157735.pdf?src-supplier=Onlinecomponents.com; ComponentLink3URL: https://datasheet.ciiva.com/46373/1678782-46373864.pdf?src-supplier=Element14; ComponentLink3Description: https://datasheet.ciiva.com/46373/1678782-46373864.pdf?src-supplier=Element14; ComponentLink4URL: https://datasheet.ciiva.com/16784/70260748-16784334.pdf?src-supplier=Allied+Electronics; ComponentLink4Description: https://datasheet.ciiva.com/16784/70260748-16784334.pdf?src-supplier=Allied+Electronics; ComponentLink5URL: https://datasheet.ciiva.com/16760/70260748-16760665.pdf?src-supplier=Allied+Electronics; ComponentLink5Description: https://datasheet.ciiva.com/16760/70260748-16760665.pdf?src-supplier=Allied+Electronics; ComponentLink6URL: https://datasheet.ciiva.com/22729/1678782-22729993.pdf?src-supplier=Farnell; ComponentLink6Description: https://datasheet.ciiva.com/22729/1678782-22729993.pdf?src-supplier=Farnell; ComponentLink7URL: https://datasheet.ciiva.com/46373/1678782-46373865.pdf?src-supplier=Element14; ComponentLink7Description: https://datasheet.ciiva.com/46373/1678782-46373865.pdf?src-supplier=Element14; ComponentLink8URL: https://datasheet.ciiva.com/9187/aoa0000ce2-9187642.pdf?src-supplier=Avnet; ComponentLink8Description: https://datasheet.ciiva.com/9187/aoa0000ce2-9187642.pdf?src-supplier=Avnet; ComponentLink9URL: https://datasheet.ciiva.com/22682/1678782-22682462.pdf?src-supplier=Element14; ComponentLink9Description: https://datasheet.ciiva.com/22682/1678782-22682462.pdf?src-supplier=Element14; ComponentLink10URL: https://datasheet.ciiva.com/43467/1678782-43467471.pdf?src-supplier=Farnell; ComponentLink10Description: https://datasheet.ciiva.com/43467/1678782-43467471.pdf?src-supplier=Farnell
R8 = Res: Resistor; Manufacturer 1: Stackpole Electronics; Manufacturer Part Number 1: RMCF1206FT2K00; VALUE: 2K; Supplier 1: Digi-Key; Supplier Part Number 1: RMCF1206FT2K00CT-ND
R9 = Res: Resistor; Manufacturer 1: Stackpole Electronics; Manufacturer Part Number 1: RMCF0603ZT0R00; VALUE: 0; Supplier 1: Digi-Key
U1 = TPS54260DRCR: Buck Inverting Buck-Boost Step Down Regulator with 3.5 to 60 V Input and 0.8 to 58 V Output, -40 to 150 degC, 10-Pin SON (DRC), Green (RoHS & no Sb/Br); Manufacturer 1: Texas Instruments; Number of Outputs: 1; Output Voltage: 58V; Output Current: 2.5A; Switching Frequency: 720kHz; Max Input Voltage: 60V; Min Input Voltage: 3.5V; Min Output Voltage: 800mV; Quiescent Current: 138uA; Output Type: Adjustable; Output Configuration: Positive; Topology: Buck-Boost; ComponentLink1Description: https://datasheet.ciiva.com/2035/tps54260-2035403.pdf?src-supplier=Digi-Key; ComponentLink1URL: https://datasheet.ciiva.com/2035/tps54260-2035403.pdf?src-supplier=Digi-Key; Supplier 1: Digi-Key; Supplier Part Number 1: 296-39416-2-ND; Manufacturer Part Number 1: TPS54260DRCR; Stock 1: 15000; Pricing 1: 3000=1.74592 (USD); RoHS: Yes; Number of Pins: 10; Contact Plating: Gold; Min Operating Temperature: -40°C; Max Operating Temperature: 125°C; Packaging: Tape and Reel; Package Quantity: 3000; Max Output Current: 2.5A; Max Output Voltage: 58V; Synchronous Rectifier: No; Lead Free: Lead Free